# Altium schematic sheet Buzzor.SchDoc
size A4
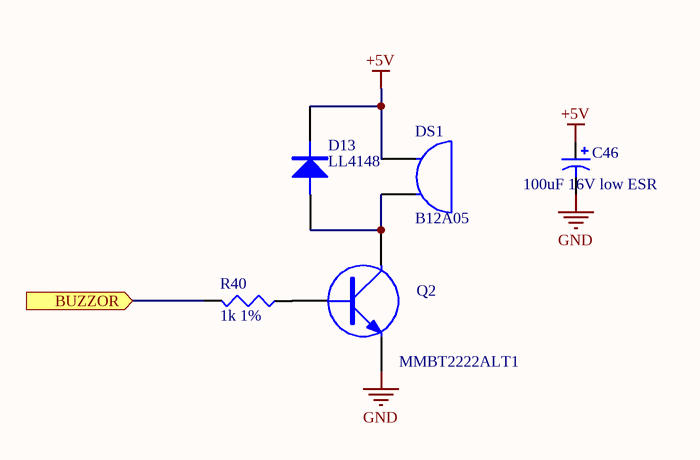
[diagram p0: Buzzor.SchDoc]

## Parts
C46  100uF 16V low ESR  [CAPPR2-5x11]
D13  LL4148  [MELF-D3513-1405]
DS1  B12A05  [BZ12/10mm]
Q2  MMBT2222ALT1  [SOT23-3N]
R40  1k 1%  [RESC2012N]

## Ports
BUZZOR (in)

## Nets
+5V: C46.1 D13.2(K) DS1.1(A)
GND: C46.2 Q2.2(E)
BUZZOR: R40.2 ; port BUZZOR
NetD13_1: D13.1(A) DS1.2(B) Q2.3(C)
NetQ2_1: Q2.1(B) R40.1

## Library data of the parts
C46 = Cap Pol1: Polarized Capacitor (Radial); Price: 0.38
D13 = DIODE
DS1 = BUZZER: HXD 5VDC dia12 h10; Price: 1.3
Q2 = NPN: NPN transistor; Price: 0.25
R40 = Res3: Resistor